# EAGLE design URTI (EAGLE 5.11)
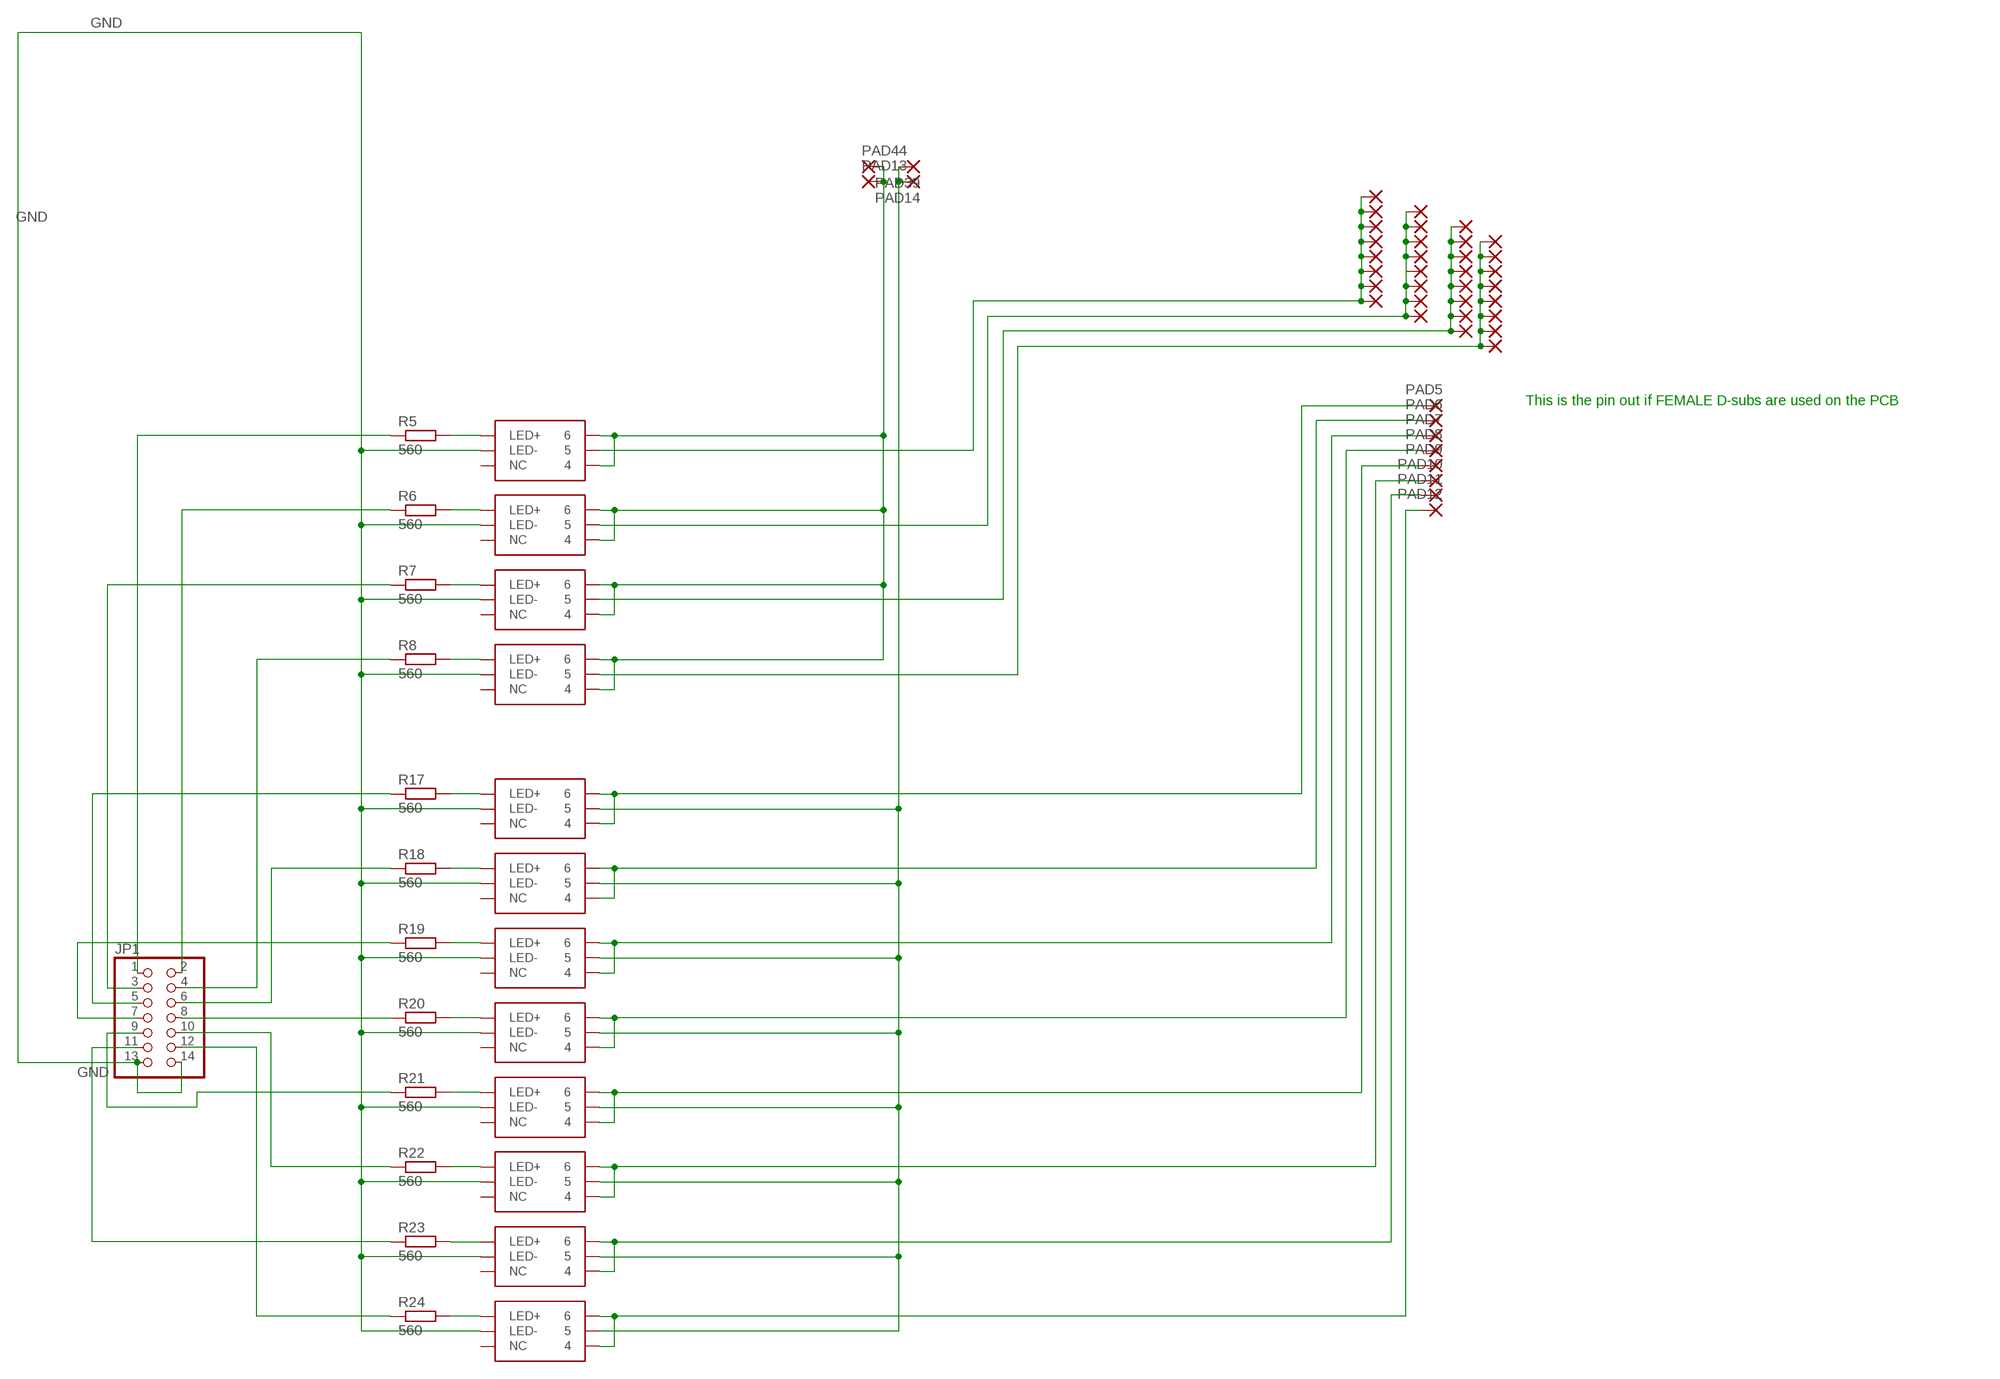
[diagram p0: schematic, sheet 1]

## Parts
JP1  PINHD-2X7  [2X07]
PAD1  1,6/0,9  [1,6/0,9]
PAD2  1,6/0,9  [1,6/0,9]
PAD3  1,6/0,9  [1,6/0,9]
PAD4  1,6/0,9  [1,6/0,9]
PAD5  1,6/0,9  [1,6/0,9]
PAD6  1,6/0,9  [1,6/0,9]
PAD7  1,6/0,9  [1,6/0,9]
PAD8  1,6/0,9  [1,6/0,9]
PAD9  1,6/0,9  [1,6/0,9]
PAD10  1,6/0,9  [1,6/0,9]
PAD11  1,6/0,9  [1,6/0,9]
PAD12  1,6/0,9  [1,6/0,9]
PAD13  3,17/1,3  [3,17/1,3]
PAD14  3,17/1,3  [3,17/1,3]
PAD15  1,6/0,9  [1,6/0,9]
PAD16  1,6/0,9  [1,6/0,9]
PAD17  1,6/0,9  [1,6/0,9]
PAD18  1,6/0,9  [1,6/0,9]
PAD19  1,6/0,9  [1,6/0,9]
PAD20  1,6/0,9  [1,6/0,9]
PAD21  1,6/0,9  [1,6/0,9]
PAD22  1,6/0,9  [1,6/0,9]
PAD23  1,6/0,9  [1,6/0,9]
PAD24  1,6/0,9  [1,6/0,9]
PAD25  1,6/0,9  [1,6/0,9]
PAD26  1,6/0,9  [1,6/0,9]
PAD27  1,6/0,9  [1,6/0,9]
PAD28  1,6/0,9  [1,6/0,9]
PAD29  1,6/0,9  [1,6/0,9]
PAD30  1,6/0,9  [1,6/0,9]
PAD31  1,6/0,9  [1,6/0,9]
PAD32  1,6/0,9  [1,6/0,9]
PAD33  1,6/0,9  [1,6/0,9]
PAD34  1,6/0,9  [1,6/0,9]
PAD35  1,6/0,9  [1,6/0,9]
PAD36  1,6/0,9  [1,6/0,9]
PAD37  1,6/0,9  [1,6/0,9]
PAD38  1,6/0,9  [1,6/0,9]
PAD39  3,17/1,3  [3,17/1,3]
PAD40  1,6/0,9  [1,6/0,9]
PAD41  1,6/0,9  [1,6/0,9]
PAD42  1,6/0,9  [1,6/0,9]
PAD43  1,6/0,9  [1,6/0,9]
PAD44  3,17/1,3  [3,17/1,3]
R5  560  R-EU_0207/10  [0207/10]
R6  560  R-EU_0207/10  [0207/10]
R7  560  R-EU_0207/10  [0207/10]
R8  560  R-EU_0207/10  [0207/10]
R17  560  R-EU_0207/10  [0207/10]
R18  560  R-EU_0207/10  [0207/10]
R19  560  R-EU_0207/10  [0207/10]
R20  560  R-EU_0207/10  [0207/10]
R21  560  R-EU_0207/10  [0207/10]
R22  560  R-EU_0207/10  [0207/10]
R23  560  R-EU_0207/10  [0207/10]
R24  560  R-EU_0207/10  [0207/10]
U$6  DIL_SW  [DIL_SW]
U$7  DIL_SW  [DIL_SW]
U$8  DIL_SW  [DIL_SW]
U$9  DIL_SW  [DIL_SW]
U$18  DIL_SW  [DIL_SW]
U$19  DIL_SW  [DIL_SW]
U$20  DIL_SW  [DIL_SW]
U$21  DIL_SW  [DIL_SW]
U$22  DIL_SW  [DIL_SW]
U$23  DIL_SW  [DIL_SW]
U$24  DIL_SW  [DIL_SW]
U$25  DIL_SW  [DIL_SW]

## Nets
GND: JP1.13 JP1.14 U$6.2(LED-) U$7.2(LED-) U$8.2(LED-) U$9.2(LED-) U$18.2(LED-) U$19.2(LED-) U$20.2(LED-) U$21.2(LED-) U$22.2(LED-) U$23.2(LED-) U$24.2(LED-) U$25.2(LED-)
LED_GND: PAD14.1(P) PAD39.1(P) U$18.5 U$19.5 U$20.5 U$21.5 U$22.5 U$23.5 U$24.5 U$25.5
LED_VCC: PAD13.1(P) PAD44.1(P) U$6.4 U$6.6 U$7.4 U$7.6 U$8.4 U$8.6 U$9.4 U$9.6
N$1: JP1.4 R8.1
N$2: JP1.2 R6.1
N$3: JP1.3 R7.1
N$4: JP1.1 R5.1
N$5: JP1.5 R17.1
N$6: JP1.6 R18.1
N$7: JP1.7 R19.1
N$8: JP1.8 R20.1
N$9: JP1.9 R21.1
N$10: R5.2 U$6.1(LED+)
N$11: JP1.10 R22.1
N$12: R6.2 U$7.1(LED+)
N$13: JP1.11 R23.1
N$14: JP1.12 R24.1
N$15: R7.2 U$8.1(LED+)
N$16: R8.2 U$9.1(LED+)
N$25: R17.2 U$18.1(LED+)
N$26: R18.2 U$19.1(LED+)
N$27: R19.2 U$20.1(LED+)
N$28: R20.2 U$21.1(LED+)
N$29: R21.2 U$22.1(LED+)
N$30: R22.2 U$23.1(LED+)
N$31: R23.2 U$24.1(LED+)
N$32: R24.2 U$25.1(LED+)
N$45: PAD2.1(P) PAD16.1(P) PAD20.1(P) PAD24.1(P) PAD31.1(P) PAD32.1(P) PAD33.1(P) PAD34.1(P) U$7.5
N$46: PAD3.1(P) PAD17.1(P) PAD21.1(P) PAD25.1(P) PAD35.1(P) PAD36.1(P) PAD37.1(P) PAD38.1(P) U$8.5
N$47: PAD4.1(P) PAD18.1(P) PAD22.1(P) PAD26.1(P) PAD40.1(P) PAD41.1(P) PAD42.1(P) PAD43.1(P) U$9.5
N$53: PAD1.1(P) PAD15.1(P) PAD19.1(P) PAD23.1(P) PAD27.1(P) PAD28.1(P) PAD29.1(P) PAD30.1(P) U$6.5
ROW1: PAD5.1(P) U$18.4 U$18.6
ROW2: PAD6.1(P) U$19.4 U$19.6
ROW3: PAD7.1(P) U$20.4 U$20.6
ROW4: PAD8.1(P) U$21.4 U$21.6
ROW5: PAD9.1(P) U$22.4 U$22.6
ROW6: PAD10.1(P) U$23.4 U$23.6
ROW7: PAD11.1(P) U$24.4 U$24.6
ROW8: PAD12.1(P) U$25.4 U$25.6
Unconnected: U$6.3(NC) U$7.3(NC) U$8.3(NC) U$9.3(NC) U$18.3(NC) U$19.3(NC) U$20.3(NC) U$21.3(NC) U$22.3(NC) U$23.3(NC) U$24.3(NC) U$25.3(NC)

## Notes on the sheet
- This is the pin out if FEMALE D-subs are used on the PCB

## Library data of the parts
JP1 = pinhead:PINHD-2X7: PIN HEADER
PAD1-PAD12 PAD15-PAD38 PAD40-PAD43 = wirepad:1,6/0,9: THROUGH-HOLE PAD
PAD13 PAD14 PAD39 PAD44 = wirepad:3,17/1,3: THROUGH-HOLE PAD
R5-R8 R17-R24 = resistor:R-EU_: RESISTOR, European symbol
U$6-U$9 U$18-U$25 = RTI:DIL_SW

## Board
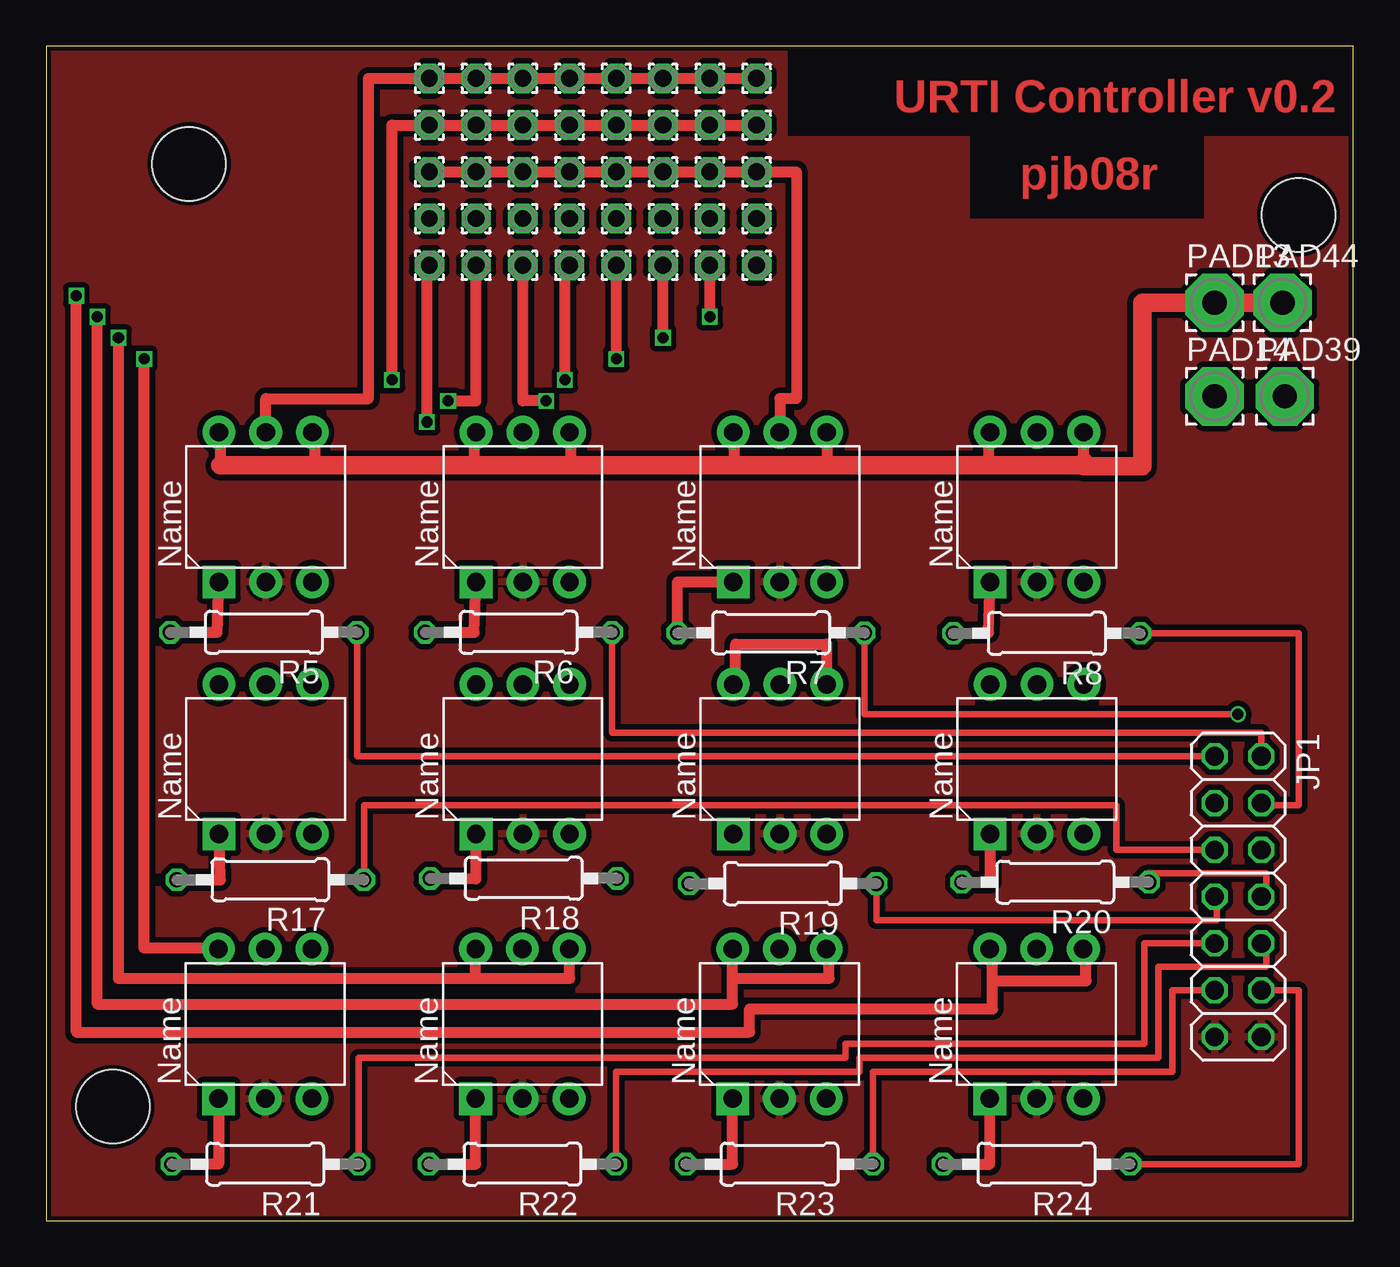
[diagram p1: board, top side]
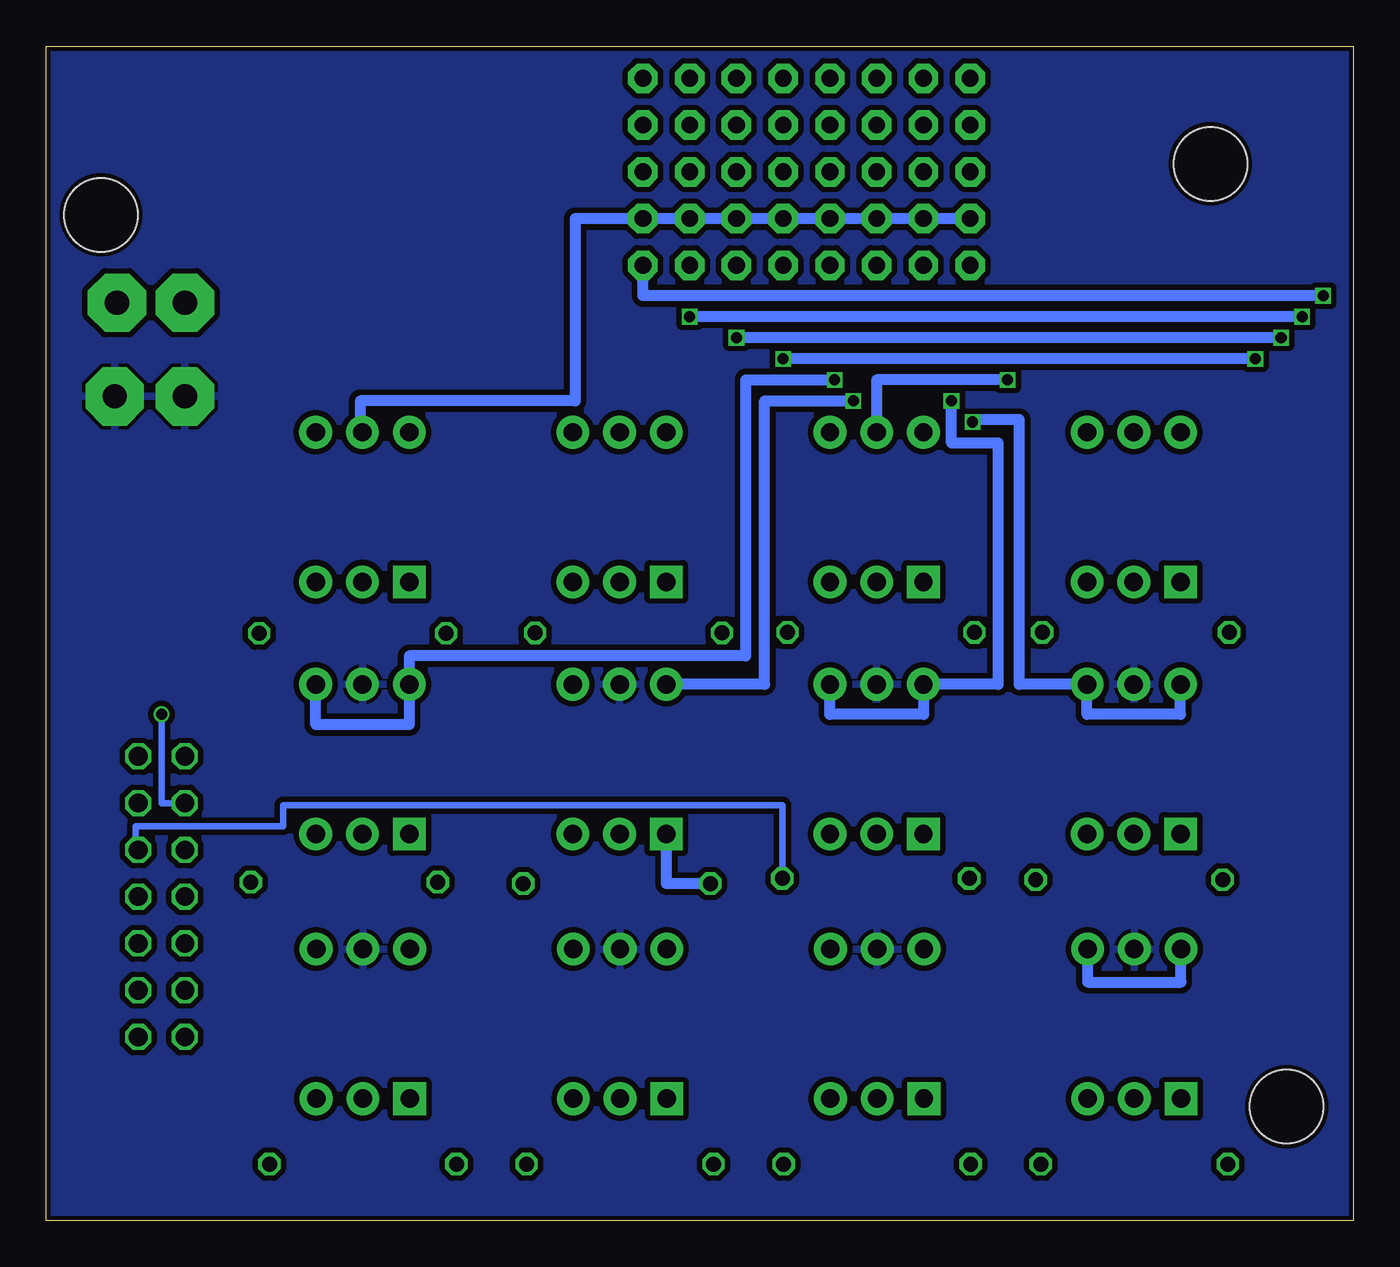
[diagram p2: board, bottom side, seen from below]

Size 71.04 x 63.8 mm. Coordinates in mm from the lower left corner, seen from the top.
Outline: 0,0 71.04,0 71.04,63.81 0,63.81 0,0
Copper layers (1*16): Top 0.035mm / dielectric 1.5mm / Bottom 0.035mm
Design rules "PCB-POOL HighSpec *": minimum track width 0.3mm, minimum drill 0.2mm, track to track 0.3mm, track to pad 0.3mm, pad to pad 0.3mm, via to via 0.3mm, smd to smd 0.3mm, copper to edge 0.25mm, drill to drill 0.2mm, minimum pad ring 0.2mm, minimum via ring 0.125mm, stop-mask expansion 0.075mm, vias tented up to drill 0mil, thermal gap 0.2mm
Holes 4 mm at 68.06,54.64 7.77,57.4 3.63,6.2
tRestrict: area 40.3,58.9 to 71.2,63.6; area 50.2,54.5 to 62.9,58.7

### Footprints (pad centres in the part's own frame; a part is rotated, then mirrored left to right if it is on the bottom)
2X07 = drill 1.016 octagon: 1 -7.62,-1.27; 2 -7.62,1.27; 3 -5.08,-1.27; 4 -5.08,1.27; 5 -2.54,-1.27; 6 -2.54,1.27; 7 0,-1.27; 8 0,1.27; 9 2.54,-1.27; 10 2.54,1.27; 11 5.08,-1.27; 12 5.08,1.27; 13 7.62,-1.27; 14 7.62,1.27
1,6/0,9 = drill 0.914 pad 1.6 octagon: 1 0,0
3,17/1,3 = drill 1.321 pad 3.175 octagon: 1 0,0
0207/10 = drill 0.813 octagon: 1 -5.08,0; 2 5.08,0
DIL_SW = drill 1 pad 1.778 square: 1 -4.064,2.54 | drill 1 pad 1.778 round: 2 -4.064,0; 3 -4.064,-2.54; 4 4.064,-2.54; 5 4.064,0; 6 4.064,2.54

### Placement (x,y rotation side)
JP1  64.77,17.6 270 top
PAD1  20.83,62.05 0 top
PAD2  20.83,59.51 0 top
PAD3  20.83,56.97 0 top
PAD4  20.83,54.43 0 top
PAD5  20.83,51.89 0 top
PAD6  23.37,51.89 0 top
PAD7  25.91,51.89 0 top
PAD8  28.45,51.89 0 top
PAD9  30.99,51.89 0 top
PAD10  33.53,51.89 0 top
PAD11  36.07,51.89 0 top
PAD12  38.61,51.89 0 top
PAD13  63.5,49.86 0 top
PAD14  63.5,44.78 0 top
PAD15  38.61,62.05 0 top
PAD16  28.45,59.51 0 top
PAD17  38.61,56.97 0 top
PAD18  38.61,54.43 0 top
PAD19  36.07,62.05 0 top
PAD20  36.07,59.51 0 top
PAD21  36.07,56.97 0 top
PAD22  33.53,54.43 0 top
PAD23  33.53,62.05 0 top
PAD24  25.91,59.51 0 top
PAD25  33.53,56.97 0 top
PAD26  30.99,54.43 0 top
PAD27  30.99,62.05 0 top
PAD28  28.45,62.05 0 top
PAD29  25.91,62.05 0 top
PAD30  23.37,62.05 0 top
PAD31  33.53,59.51 0 top
PAD32  38.61,59.51 0 top
PAD33  30.99,59.51 0 top
PAD34  23.37,59.51 0 top
PAD35  25.91,56.97 0 top
PAD36  28.45,56.97 0 top
PAD37  30.99,56.97 0 top
PAD38  23.37,56.97 0 top
PAD39  67.31,44.78 0 top
PAD40  36.07,54.43 0 top
PAD41  25.91,54.43 0 top
PAD42  28.45,54.43 0 top
PAD43  23.37,54.43 0 top
PAD44  67.18,49.86 0 top
R5  11.84,31.96 180 top
R6  25.68,31.96 180 top
R7  39.4,31.93 180 top
R8  54.38,31.91 180 top
R17  12.19,18.52 180 top
R18  25.96,18.59 180 top
R19  40.03,18.31 180 top
R20  54.84,18.39 180 top
R21  11.91,3.07 180 top
R22  25.88,3.07 180 top
R23  39.85,3.07 180 top
R24  53.82,3.07 180 top
U$6  11.94,38.76 90 top
U$7  25.91,38.76 90 top
U$8  39.88,38.76 90 top
U$9  53.85,38.76 90 top
U$18  11.94,25.07 90 top
U$19  25.91,25.07 90 top
U$20  39.88,25.07 90 top
U$21  53.85,25.07 90 top
U$22  11.91,10.69 90 top
U$23  25.88,10.69 90 top
U$24  39.85,10.69 90 top
U$25  53.82,10.69 90 top

### Tracks (layer width: path | path; a pad name or v marks a point on that pad's centre or on a via)
GND
  pour Top: -3.43,65.99 76.33,65.86 73.79,-2.13 -3.94,-3.91
LED_GND
  pour Bottom: -8.64,70.43 79.12,70.31 76.71,-6.2 -6.02,-8.89
LED_VCC
  Top 0.61: 9.47,41.02 9.47,42.83 U$6.6 9.4,42.57 | 56.39,41.02 56.39,41.22 U$9.4 | U$6.4 14.63,42.83 14.63,41.02 | U$7.6 23.29,42.83 23.29,41.02 | U$7.4 28.52,42.83 28.52,41.02 | U$8.6 37.41,42.83 37.41,41.02 | U$8.4 42.47,42.83 42.47,41.02 | U$9.6 51.23,42.83 51.23,41.02
  Top 1.016: 9.47,41.02 14.63,41.02 23.29,41.02 28.52,41.02 37.41,41.02 42.47,41.02 51.23,41.02 56.39,41.02 | PAD44.1 PAD13.1 59.56,49.86 59.56,40.97 56.39,40.97 56.39,41.22
N$1
  Top 0.356: R8.1 68.07,31.91 68.07,22.56 66.04,22.56 JP1.4
N$2
  Top 0.356: JP1.2 66.04,26.49 30.76,26.49 R6.1
N$3  (via drill 0.6)
  Top 0.356: v64.77,27.51 44.47,27.51 R7.1
  Bottom 0.356: JP1.3 64.77,22.68 v64.77,27.51
N$4
  Top 0.356: JP1.1 16.92,25.22 R5.1
N$5
  Top 0.356: JP1.5 58.17,20.14 58.17,22.56 17.27,22.56 R17.1
N$6
  Bottom 0.356: JP1.6 66.17,20.14 66.17,21.41 58.17,21.41 58.17,22.56 31.04,22.56 R18.1
N$7
  Top 0.356: JP1.7 63.63,17.6 63.63,16.33 45.11,16.33 R19.1
N$8
  Top 0.356: JP1.8 66.29,17.6 66.29,18.87 59.92,18.87 R20.1
N$9
  Top 0.356: JP1.9 59.69,15.06 59.69,9.6 43.43,9.6 43.43,8.84 16.99,8.84 R21.1
N$10
  Top 0.61: R5.2 9.3,31.96 U$6.1
N$11
  Top 0.356: JP1.10 66.29,15.06 66.29,13.79 60.45,13.79 60.45,8.84 44.2,8.84 44.2,8.08 30.96,8.08 R22.1
N$12
  Top 0.61: R6.2 23.27,31.96 U$7.1
N$13
  Top 0.356: JP1.11 61.21,12.52 61.21,8.08 44.93,8.08 R23.1
N$14
  Top 0.356: R24.1 68.07,3.07 68.07,12.52 JP1.12
N$15
  Top 0.61: U$8.1 34.31,34.7 R7.2
N$16
  Top 0.61: R8.2 51.21,31.96 U$9.1
N$25
  Top 0.61: R17.2 9.47,18.52 U$18.1
N$26
  Top 0.61: R18.2 23.37,18.57 U$19.1
N$27
  Bottom 0.61: R19.2 37.34,18.31 U$20.1
N$28
  Top 0.61: R20.2 51.31,18.39 U$21.1
N$29
  Top 0.61: R21.2 9.37,3.07 U$22.1
N$30
  Top 0.61: R22.2 23.34,3.07 U$23.1
N$31
  Top 0.61: R23.2 37.31,3.07 U$24.1
N$32
  Top 0.61: R24.2 51.28,3.07 U$25.1
N$45  (via drill 0.6)
  Top 0.61: PAD32.1 PAD20.1 PAD31.1 PAD33.1 PAD16.1 PAD24.1 PAD34.1 PAD2.1 18.8,59.51 v18.8,45.67
  Bottom 0.61: v18.8,45.67 25.91,45.67 U$7.5
N$46
  Top 0.61: PAD3.1 PAD38.1 PAD35.1 PAD36.1 PAD37.1 PAD25.1 PAD21.1 PAD17.1 40.77,56.97 40.77,44.65 39.88,44.65 U$8.5
N$47
  Bottom 0.61: U$9.5 53.97,42.83 53.97,44.53 42.29,44.53 42.29,54.43 PAD18.1 PAD40.1 PAD22.1 PAD26.1 PAD42.1 PAD41.1 PAD43.1 PAD4.1
N$53
  Top 0.61: U$6.5 11.94,44.65 17.53,44.65 17.53,62.05 PAD1.1 PAD30.1 PAD29.1 PAD28.1 PAD27.1 PAD23.1 PAD19.1 PAD15.1
ROW1  (via drill 0.6)
  Top 0.61: PAD5.1 20.7,51.89 v20.7,43.38
  Bottom 0.61: U$18.6 9.4,27.51 14.48,27.51 U$18.4 18.16,29.13 18.16,43.51 20.83,43.51 v20.7,43.38
ROW2  (via drill 0.6)
  Top 0.61: v21.84,44.53 23.37,44.53 PAD6.1
  Bottom 0.61: U$19.4 28.45,27.51 23.37,27.51 U$19.6 19.3,29.13 19.3,42.24 21.84,42.24 v21.84,44.53
ROW3  (via drill 0.6)
  Top 0.61: v27.18,44.53 25.91,44.53 PAD7.1 | U$20.6 37.47,29.13 37.47,31.32 42.42,31.32 U$20.4
  Bottom 0.61: U$20.6 32,29.13 32,44.53 v27.18,44.53
ROW4  (via drill 0.6)
  Top 0.61: PAD8.1 28.19,51.89 v28.19,45.67
  Bottom 0.61: U$21.4 56.39,26.95 51.31,26.95 U$21.6 51.31,30.68 33.02,30.68 33.02,45.67 v28.19,45.67
ROW5  (via drill 0.6)
  Top 0.61: v30.99,46.81 PAD9.1 | v5.33,46.81 5.33,14.81 9.37,14.81 U$22.6
  Bottom 0.61: U$22.6 9.37,12.95 14.45,12.95 U$22.4 | v5.33,46.81 v30.99,46.81
ROW6  (via drill 0.6)
  Top 0.61: v33.53,47.96 PAD10.1 | v3.94,47.96 3.94,13.16 23.34,13.16 | 23.34,13.16 U$23.6 | U$23.4 28.45,14.76 28.45,13.16 23.34,13.16
  Bottom 0.61: v3.94,47.96 v33.53,47.96
ROW7  (via drill 0.6)
  Top 0.61: v36.07,49.1 PAD11.1 | v2.79,49.1 2.79,11.76 37.31,11.76 37.31,13.16 | 37.31,13.16 U$24.6 | U$24.4 42.55,14.76 42.55,13.16 37.31,13.16
  Bottom 0.61: v2.79,49.1 v36.07,49.1
ROW8  (via drill 0.6)
  Top 0.61: U$25.6 51.44,14.76 51.44,13.03 | 51.44,13.03 51.44,11.51 38.23,11.51 38.23,10.24 1.65,10.24 v1.65,50.24 | U$25.4 56.52,14.76 56.52,13.03 51.44,13.03
  Bottom 0.61: v1.65,50.24 38.61,50.24 PAD12.1

### Text on the board
Top: URTI Controller v0.2 | pjb08r